# Altium schematic sheet SCH_BoargV1.SchDoc
size 420 x 297 mm; PageSetup: Record=PageOptions|CenterHorizontal=True|CenterVertical=True|PrintScale=1.00|XCorrection=1.00|YCorrection=1.00|PrintKind=1|BorderSize=5000000|LeftOffset=0|BottomOffset=0|Orientation=2|PaperLength=1000|PaperWidth=1000|Scale=100|PaperSource=15|PrintQuality=1200|MediaType=1|DitherType=10|PaperKind=A3|PrintScaleMode=1; Weight: -; ScaleFactor: -; NormInspection: Норм.Контр.; Scale: 1:1; Разраб.: Иванов; Обозначение документа: АБВГ.123456.001 Э3; Пров.: Петров; Утв.: Сидоров; Наименование организации: ОАО "Концерн "МПО-Гидроприбор"; Перв. применение: АБВГ.123456.000; Наименование изделия 1: Плата; Наименование изделия 2: Схема электрическая; Наименование изделия 3: принципиальная; Нач. отд.: Нач. отд.; Фамилия нач. отд.: Сидоров
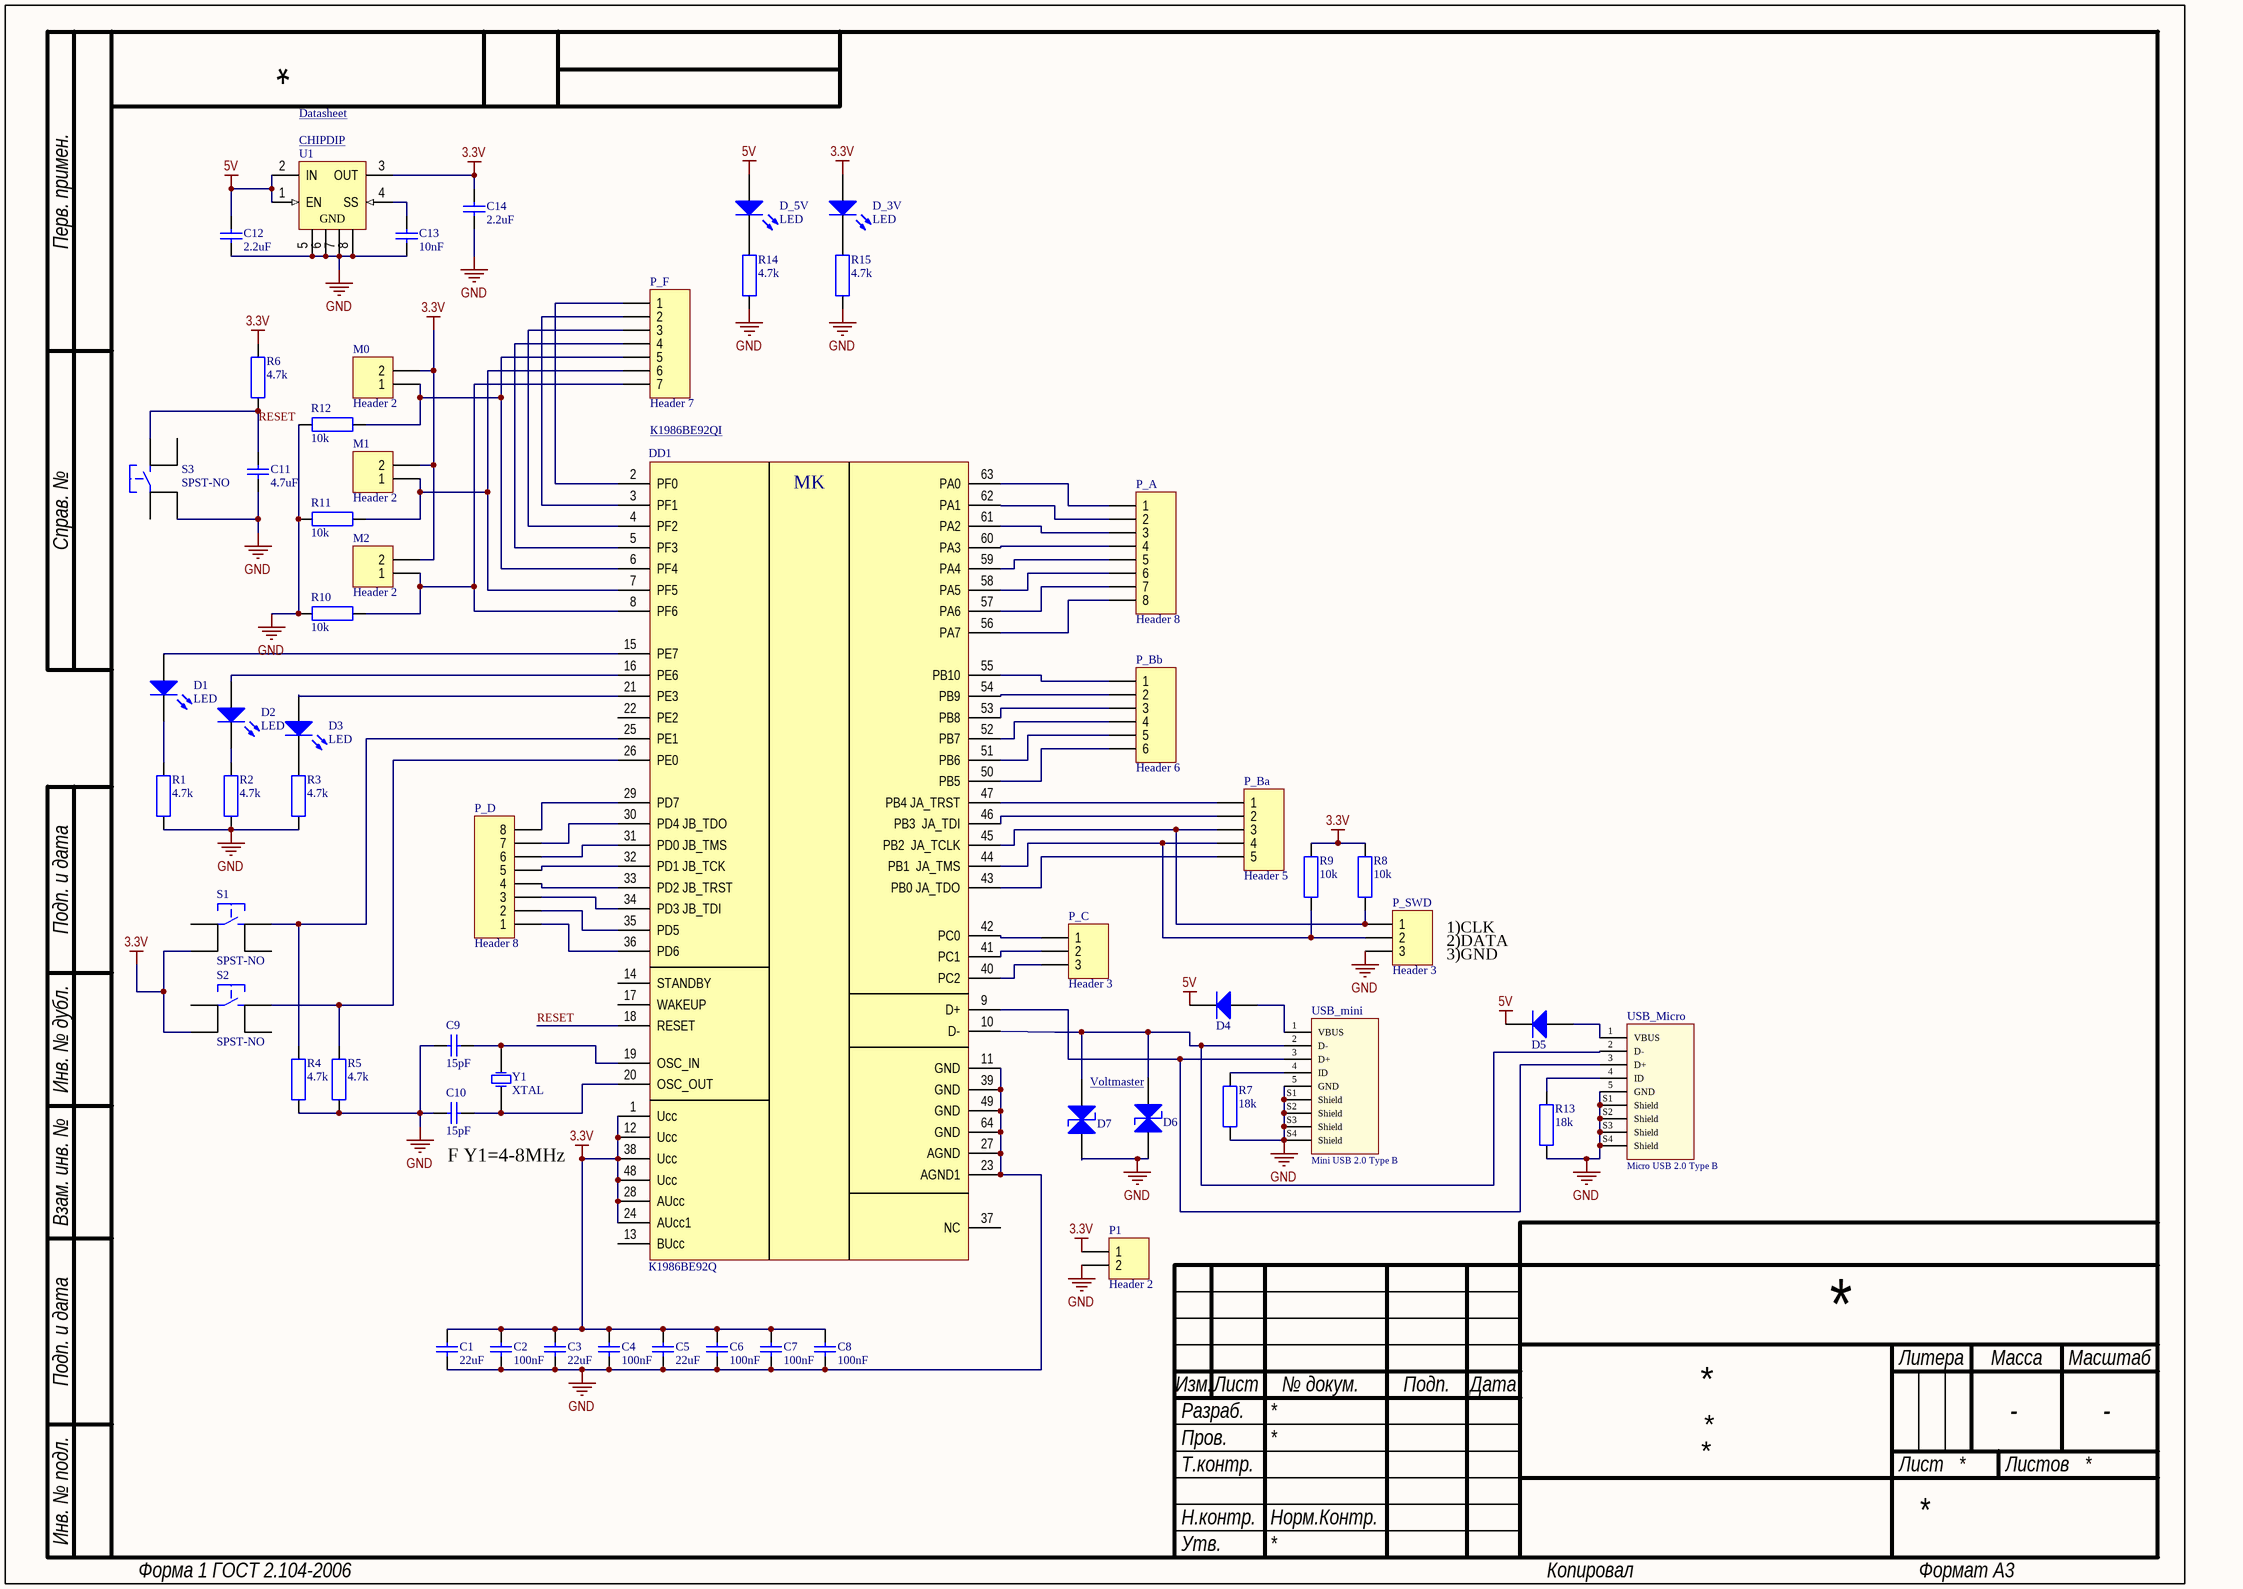
[diagram p0: SCH_BoargV1.SchDoc]

## Parts
C1  value 22uF  [C0805C]  (hidden comment: CAP)
C2  value 100nF  [C0805C]  (hidden comment: CAP)
C3  value 22uF  [C0805C]  (hidden comment: CAP)
C4  value 100nF  [C0805C]  (hidden comment: CAP)
C5  value 22uF  [C0805C]  (hidden comment: CAP)
C6  value 100nF  [C0805C]  (hidden comment: CAP)
C7  value 100nF  [C0805C]  (hidden comment: CAP)
C8  value 100nF  [C0805C]  (hidden comment: CAP)
C9  value 15pF  [C0805C]  (hidden comment: CAP)
C10  value 15pF  [C0805C]  (hidden comment: CAP)
C11  value 4.7uF  [C0805C]  (hidden comment: CAP)
C12  value 2.2uF  [C0805C]  (hidden comment: CAP)
C13  value 10nF  [C0805C]  (hidden comment: CAP)
C14  value 2.2uF  [C0805C]  (hidden comment: CAP)
D1  LED  [LED1206G]
D2  LED  [LED1206R]
D3  LED  [LED1206Y]
D4  Diode  [DSO-C2/X1.8]  (value not drawn)
D5  Diode  [DSO-C2/X1.8]  (value not drawn)
D6  DiodeTVS  [DIOM4336X22N]  (value not drawn)
D7  DiodeTVS  [DIOM4336X22N]  (value not drawn)
D_3V  LED  [LED1206R]
D_5V  LED  [LED1206R]
DD1  К1986ВЕ92Q  [TSQFP50P1200X1200X160-64N]
M0  Header 2  [HDR1X2J]
M1  Header 2  [HDR1X2J]
M2  Header 2  [HDR1X2J]
P1  Header 2  [HDR1X2]
P_A  Header 8  [HDR1X8]
P_Ba  Header 5  [HDR1X5]
P_Bb  Header 6  [HDR1X6]
P_C  Header 3  [HDR1X3]
P_D  Header 8  [HDR1X8]
P_F  Header 7  [HDR1X7]
P_SWD  Header 3  [HDR1X3]
R1  value 4.7k  [C0805R]  (hidden comment: RES)
R2  value 4.7k  [C0805R]  (hidden comment: RES)
R3  value 4.7k  [C0805R]  (hidden comment: RES)
R4  value 4.7k  [C0805R]  (hidden comment: RES)
R5  value 4.7k  [C0805R]  (hidden comment: RES)
R6  value 4.7k  [C0805R]  (hidden comment: RES)
R7  value 18k  [C0805R]  (hidden comment: RES)
R8  value 10k  [C0805R]  (hidden comment: RES)
R9  value 10k  [C0805R]  (hidden comment: RES)
R10  value 10k  [C0805R]  (hidden comment: RES)
R11  value 10k  [C0805R]  (hidden comment: RES)
R12  value 10k  [C0805R]  (hidden comment: RES)
R13  value 18k  [C0805R]  (hidden comment: RES)
R14  value 4.7k  [C0805R]  (hidden comment: RES)
R15  value 4.7k  [C0805R]  (hidden comment: RES)
S1  SPST-NO  [SPST-NO]
S2  SPST-NO  [SPST-NO]
S3  SPST-NO  [SPST-NO]
U1  ADP1715ARMZ-3.3-R7  [ADI-RM-8_N]  (value not drawn)
USB_Micro  Micro USB 2.0 Type B  [629105136821]
USB_mini  Mini USB 2.0 Type B  [65100516121]
Y1  XTAL  [HC49SMD C]

## Nets
3.3V: C1.2 C2.2 C3.2 C4.2 C5.2 C6.2 C7.2 C8.2 C14.2 D_3V.1(A) DD1.1(Ucc) DD1.12(Ucc) DD1.24(AUcc1) DD1.28(AUcc) DD1.38(Ucc) DD1.48(Ucc) M0.2 M1.2 M2.2 P1.1 R6.1 R8.2 R9.2 S1.2 S2.2 U1.3(OUT)
5V: C12.2 D4.K D5.K D_5V.1(A) U1.1(EN) U1.2(IN)
GND: C1.1 C2.1 C3.1 C4.1 C5.1 C6.1 C7.1 C8.1 C9.2 C10.2 C11.1 C12.1 C13.1 C14.1 D6.A D7.A DD1.11(GND) DD1.23(AGND1) DD1.27(AGND) DD1.39(GND) DD1.49(GND) DD1.64(GND) P1.2 P_SWD.3 R1.1 R2.1 R3.1 R4.1 R5.1 R7.1 R10.2 R11.1 R12.1 R13.1 R14.1 R15.1 S3.2 U1.5(GND) U1.6(GND) U1.7(GND) U1.8(GND) USB_Micro.5(GND) USB_Micro.S1(Shield) USB_Micro.S2(Shield) USB_Micro.S3(Shield) USB_Micro.S4(Shield) USB_mini.5(GND) USB_mini.S1(Shield) USB_mini.S2(Shield) USB_mini.S3(Shield) USB_mini.S4(Shield)
RESET: C11.2 DD1.18(RESET) R6.2 S3.4
NetC9_1: C9.1 DD1.19(OSC_IN) Y1.2(OSC2)
NetC10_1: C10.1 DD1.20(OSC_OUT) Y1.1(OSC1)
NetC13_2: C13.2 U1.4(SS)
NetD1_1: D1.1(A) DD1.15(PE7)
NetD1_2: D1.2(K) R1.2
NetD2_1: D2.1(A) DD1.16(PE6)
NetD2_2: D2.2(K) R2.2
NetD3_1: D3.1(A) DD1.21(PE3)
NetD3_2: D3.2(K) R3.2
NetD4_A: D4.A USB_mini.1(VBUS)
NetD5_A: D5.A USB_Micro.1(VBUS)
NetD6_K: D6.K D7.K DD1.10(D-) USB_Micro.2(D-) USB_mini.2(D-)
NetD_3V_2: D_3V.2(K) R15.2
NetD_5V_2: D_5V.2(K) R14.2
NetDD1_2: DD1.2(PF0) P_F.1
NetDD1_3: DD1.3(PF1) P_F.2
NetDD1_4: DD1.4(PF2) P_F.3
NetDD1_5: DD1.5(PF3) P_F.4
NetDD1_6: DD1.6(PF4) M0.1 P_F.5 R12.2
NetDD1_7: DD1.7(PF5) M1.1 P_F.6 R11.2
NetDD1_8: DD1.8(PF6) M2.1 P_F.7 R10.1
NetDD1_9: DD1.9(D+) USB_Micro.3(D+) USB_mini.3(D+)
NetDD1_25: DD1.25(PE1) R4.2 S1.4
NetDD1_26: DD1.26(PE0) R5.2 S2.4
NetDD1_29: DD1.29(PD7) P_D.8
NetDD1_30: DD1.30(PD4_JB_TDO) P_D.7
NetDD1_31: DD1.31(PD0_JB_TMS) P_D.6
NetDD1_32: DD1.32(PD1_JB_TCK) P_D.5
NetDD1_33: DD1.33(PD2_JB_TRST) P_D.4
NetDD1_34: DD1.34(PD3_JB_TDI) P_D.3
NetDD1_35: DD1.35(PD5) P_D.2
NetDD1_36: DD1.36(PD6) P_D.1
NetDD1_40: DD1.40(PC2) P_C.3
NetDD1_41: DD1.41(PC1) P_C.2
NetDD1_42: DD1.42(PC0) P_C.1
NetDD1_43: DD1.43(PB0_JA_TDO) P_Ba.5
NetDD1_44: DD1.44(PB1__JA_TMS) P_Ba.4 P_SWD.2 R9.1
NetDD1_45: DD1.45(PB2__JA_TCLK) P_Ba.3 P_SWD.1 R8.1
NetDD1_46: DD1.46(PB3__JA_TDI) P_Ba.2
NetDD1_47: DD1.47(PB4_JA_TRST) P_Ba.1
NetDD1_50: DD1.50(PB5) P_Bb.6
NetDD1_51: DD1.51(PB6) P_Bb.5
NetDD1_52: DD1.52(PB7) P_Bb.4
NetDD1_53: DD1.53(PB8) P_Bb.3
NetDD1_54: DD1.54(PB9) P_Bb.2
NetDD1_55: DD1.55(PB10) P_Bb.1
NetDD1_56: DD1.56(PA7) P_A.8
NetDD1_57: DD1.57(PA6) P_A.7
NetDD1_58: DD1.58(PA5) P_A.6
NetDD1_59: DD1.59(PA4) P_A.5
NetDD1_60: DD1.60(PA3) P_A.4
NetDD1_61: DD1.61(PA2) P_A.3
NetDD1_62: DD1.62(PA1) P_A.2
NetDD1_63: DD1.63(PA0) P_A.1
NetR7_2: R7.2 USB_mini.4(ID)
NetR13_2: R13.2 USB_Micro.4(ID)

Not connected (* = marked no-connect by the designer): DD1 13(BUcc) 14(STANDBY) 17(WAKEUP) 22(PE2) 37(NC); S1 1 3; S2 1 3; S3 1 3

## Notes on the sheet
- Datasheet <https://www.analog.com/media/en/technical-documentation/data-sheets/ADP1715_1716.pdf>
- (near U1) CHIPDIP <https://www.chipdip.ru/product1/8001055314>
- К1986ВЕ92QI <https://ic.milandr.ru/products/mikrokontrollery_i_protsessory/k1986ve92qi/>
- 1)CLK
- 2)DATA
- 3)GND
- Voltmaster <http://www.voltmaster.ru/cgi-bin/qwery.pl/id=2010076902>
- (near C10) F Y1=4-8MHz
- Перв. примен.
- Справ. №
- Подп. и дата
- Инв. № дубл.
- Взам. инв. №
- Разраб.
- Изм.
- Лист
- № докум.
- Подп.
- Дата
- Литера
- Масса
- Масштаб
- Пров.
- Т.контр.
- Листов
- Инв. № подл.
- Н.контр.
- Утв.
- Форма 1 ГОСТ 2.104-2006
- Копировал
- Формат А3
- (in symbol К1986ВЕ92Q) MK

## Library data of the parts
C1-C14 = CAP: Capacitor; Published: 8-Jun-2000; LatestRevisionDate: 29-May-2009; LatestRevisionNote: IPC-7351 Footprint Added.; PackageReference: C1206; Publisher: Altium Limited; PackageDescription: Chip Capacitor
D1-D3 D_3V D_5V = LED: Typical LED; Published: 8-Jun-2000; LatestRevisionDate: 17-Jul-2002; LatestRevisionNote: Re-released for DXP Platform.; PackageVersion: Feb-2002; PackageReference: 3.2X1.6X1.1; Publisher: Altium Limited; PackageDescription: SM LED; 2 Flat Leads
D4 D5 = Diode: Default Diode; Published: 8-Jun-2000; LatestRevisionDate: 17-Jul-2002; LatestRevisionNote: Re-released for DXP Platform.; PackageVersion: Sep-1996; PackageReference: SMC; Publisher: Altium Limited; PackageDescription: DO-214-AB/SMC; 2 C-Bend Leads; Body 7.9 x 5.9 mm, inc. leads (LxW); Code_JEDEC: DO-214-AB
D6 D7 = DiodeTVS: Diode TVS; Published: 8-Jun-2000; LatestRevisionDate: 17-Jul-2002; LatestRevisionNote: Re-released for DXP Platform.; PackageVersion: Sep-1996; PackageReference: SMC; Publisher: Altium Limited; PackageDescription: DO-214-AB/SMC; 2 C-Bend Leads; Body 7.9 x 5.9 mm, inc. leads (LxW); Code_JEDEC: DO-214-AB
M0-M2 P1 = Header 2: Header, 2-Pin; LatestRevisionDate: 17-Jul-2002; LatestRevisionNote: Re-released for DXP Platform.; Publisher: Altium Limited
P_A P_D = Header 8: Header, 8-Pin; LatestRevisionDate: 17-Jul-2002; LatestRevisionNote: Re-released for DXP Platform.; Publisher: Altium Limited
P_Ba = Header 5: Header, 5-Pin; LatestRevisionDate: 17-Jul-2002; LatestRevisionNote: Re-released for DXP Platform.; Publisher: Altium Limited
P_Bb = Header 6: Header, 6-Pin; LatestRevisionDate: 17-Jul-2002; LatestRevisionNote: Re-released for DXP Platform.; Publisher: Altium Limited
P_C P_SWD = Header 3: Header, 3-Pin; LatestRevisionDate: 17-Jul-2002; LatestRevisionNote: Re-released for DXP Platform.; Publisher: Altium Limited
P_F = Header 7: Header, 7-Pin; LatestRevisionDate: 17-Jul-2002; LatestRevisionNote: Re-released for DXP Platform.; Publisher: Altium Limited
R1-R15 = RES: Resistor; Published: 8-Jun-2000; LatestRevisionDate: 29-May-2009; LatestRevisionNote: IPC-7351 Footprint Added.; PackageReference: J1-0603; Publisher: Altium Limited; PackageDescription: Chip Resistor
S1-S3 = SPST-NO: Tactile Switch 7.3mm, SMD
U1 = ADP1715ARMZ-3.3-R7: 500 mA, Low Dropout, CMOS Linear Regulator, 2.5 to 5.5 V Vin, 3.3 V Vout, Industrial, 8-pin SOP (RM-8), Reel; Manufacturer: Analog Devices; Iout max: 500mA; Preset Vout Values (V): 3.3; Supply Current IGND @ Small Load: 65uA; Vin (max) (V): 5.5; Vin (min) (V): 2.5; DatasheetVersion: Rev. 0; PackageVersion: Aug-05; PackageReference: RM-8; PackageDescription: 8-Pin Mini Small Outline Package, Body 3 x 3 mm, Pitch 0.65 mm; Supplier 1: Digi-Key; Supplier Part Number 1: ADP1715ARMZ-3.3-R7TR-ND; Supplier 2: Digi-Key; Supplier Part Number 2: ADP1715ARMZ-3.3-R7CT-ND; Supplier 3: Digi-Key; Supplier Part Number 3: ADP1715ARMZ-3.3-R7DKR-ND; Supplier 4: Farnell; Supplier Part Number 4: 2376927; Supplier 5: Newark; Supplier Part Number 5: 23X6019; Supplier 6: Newark; Supplier Part Number 6: 28M3820; Supplier 7: Mouser; Supplier Part Number 7: 584-ADP1715ARMZ3.3R7; Packing: Reel; Mounting Technology: Surface Mount; Code_JEDEC: MO-187-AA; PartNumber: ADP1715ARMZ-3.3-R7; ComponentLink1Description: Manufacturer URL; ComponentLink1URL: http://www.analog.com/en/index.html; ComponentLink2Description: Datasheet; ComponentLink2URL: http://www.analog.com/static/imported-files/data_sheets/ADP1715_1716.pdf; ComponentLink3Description: Package Specification; ComponentLink3URL: http://www.analog.com/static/imported-files/packages/PKG_PDF/MSOP%28RM%29/RM_8.pdf; ComponentLink4Description: URL Link1; ComponentLink4URL: Product URL:http://www.analog.com/en/ADP1715/productSearch.html
USB_Micro = 629105136821: Micro USB 2.0 Type B Horizontal SMT 5 Contacts WR-COM; Rated Current: 1 A; Gender: Female; ComponentLink1Description: Manufacturer; ComponentLink1URL: http://www.we-online.de; ComponentLink2Description: Datasheet; ComponentLink2URL: http://katalog.we-online.de/em/datasheet/629105136821.pdf; Part Number: 629105136821; Published Date: May 2018; Publisher: Wurth Elektronik; Orientation: Horizontal; Interface Type: Micro USB 2.0 Type B; Operating Temperature: -40 to 85 degC; Mounting Technology: SMT; Packaging: Tape and Reel
USB_mini = 65100516121: Mini USB 2.0 Type B Horizontal SMT 5 Contacts WR-COM; Rated Current: 1 A; Gender: Female; ComponentLink1Description: Manufacturer; ComponentLink1URL: http://www.we-online.de; ComponentLink2Description: Datasheet; ComponentLink2URL: http://katalog.we-online.de/em/datasheet/65100516121.pdf; Part Number: 65100516121; Published Date: May 2018; Publisher: Wurth Elektronik; Orientation: Horizontal; Interface Type: Mini USB 2.0 Type B; Operating Temperature: -40 to 105 degC; Mounting Technology: SMT; Packaging: Tray
Y1 = XTAL: Crystal Oscillator; Published: 8-Jun-2000; LatestRevisionDate: 17-Jul-2002; LatestRevisionNote: Re-released for DXP Platform.; PackageReference: R38; Publisher: Altium Limited; PackageDescription: Crystal, Thru-Hole; 2 Leads; Body 3.1 x 8.2 mm (Dia.xH)